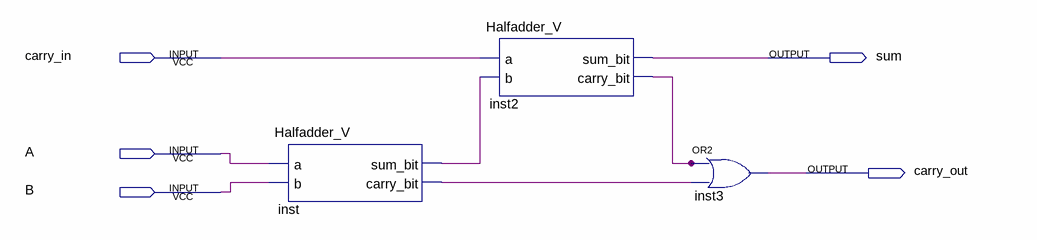
[diagram p0: schematic sheet]
// Quartus schematic Volladder.bdf as structural Verilog: 3 symbols, 5 pins
module Volladder (
  input  carry_in,
  input  A,
  input  B,
  output sum,
  output carry_out
);

  wire inst2_carry_bit, inst_carry_bit, inst_sum_bit;

  Halfadder_V inst (.a(A), .b(B), .sum_bit(inst_sum_bit), .carry_bit(inst_carry_bit));
  Halfadder_V inst2 (.a(carry_in), .b(inst_sum_bit), .sum_bit(sum), .carry_bit(inst2_carry_bit));
  or inst3 (carry_out, inst2_carry_bit, inst_carry_bit);
endmodule
